# Altium schematic sheet EQDirect.SchDoc
size A4
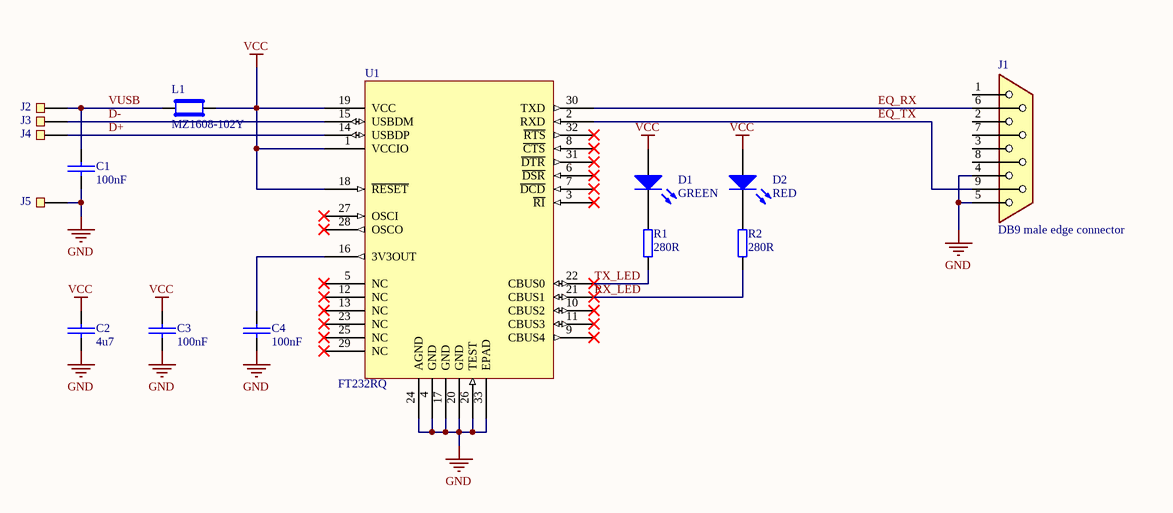
[diagram p0: EQDirect.SchDoc]

## Parts
C1  100nF  [C0603]
C2  4u7  [C0603]
C3  100nF  [C0603]
C4  100nF  [C0603]
D1  GREEN  [LED_0603_GREEN]
D2  RED  [LED_0603_RED]
J1  DB9 male edge connector  [DB9-M-EDGE]
J2  TH_PAD  [TH_PAD]  (value not drawn)
J3  TH_PAD  [TH_PAD]  (value not drawn)
J4  TH_PAD  [TH_PAD]  (value not drawn)
J5  TH_PAD  [TH_PAD]  (value not drawn)
L1  MZ1608-102Y  [L0603]
R1  280R  [R0603]
R2  280R  [R0603]
U1  FT232RQ  [QFN50P500X500X100_HS-33N]

## Nets
GND: C1.1 C2.1 C3.1 C4.1 J1.4 J1.5 J5.1 U1.4(GND) U1.17(GND) U1.20(GND) U1.24(AGND) U1.26(TEST) U1.33(EPAD)
VCC: C2.2 C3.2 D1.1(A) D2.1(A) L1.1 U1.1(VCCIO) U1.18(~{RESET}) U1.19(VCC)
D+: J4.1 U1.14(USBDP)
D-: J3.1 U1.15(USBDM)
EQ_RX: J1.6 U1.30(TXD)
EQ_TX: J1.9 U1.2(RXD)
RX_LED: R2.1 U1.21(CBUS1)
TX_LED: R1.1 U1.22(CBUS0)
VUSB: C1.2 J2.1 L1.2
NetC4_2: C4.2 U1.16(3V3OUT)
NetD1_2: D1.2(K) R1.2
NetD2_2: D2.2(K) R2.2

Not connected (* = marked no-connect by the designer): J1 1 2 3 7 8; U1 3(~{RI})* 5(NC)* 6(~{DSR})* 7(~{DCD})* 8(~{CTS})* 9(CBUS4)* 10(CBUS2)* 11(CBUS3)* 12(NC)* 13(NC)* 23(NC)* 25(NC)* 27(OSCI)* 28(OSCO)* 29(NC)* 31(~{DTR})* 32(~{RTS})*

## Library data of the parts
C1 C3 C4 = C0603C104K5RACTU: CAP CER 0.1UF 50V X7R 0603; Manufacturer: Kemet; Capacitance: 0.10µF; Tolerance: ±10%; Part Number: C0603C104K5RACTU; Value: 100nF; Supplier 1: Digi-Key; Supplier Part Number 1: 399-5089-1-ND; Manufacturer Part Number: C0603C104K5RACTU; RoHS: RoHS Compliant; Category: Capacitors; Stock 1: 1628757; Pricing 1: 1=0.09, 10=0.037, 50=0.0198, 100=0.0167, 250=0.01372, 500=0.01174, 1000=0.00914 (EUR); Packaging: Cut Tape (CT); Voltage - Rated: 50V; Temperature Coefficient: X7R; Mounting Type: Surface Mount, MLCC; Operating Temperature: -55°C ~ 125°C; Applications: General Purpose; Ratings: -; Package / Case: 0603 (1608 Metric); Size / Dimension: 0.063" L x 0.031" W (1.60mm x 0.80mm); Height - Seated (Max): -; Thickness (Max): 0.034" (0.87mm); Lead Spacing: -; Features: -; Lead Style: -; ComponentLink1URL: http://www.kemet.com/docfinder?Partnumber=C0603C104K5RACTU; ComponentLink1Description: http://www.kemet.com/docfinder?Partnumber=C0603C104K5RACTU
C2 = GRM188R6YA475KE15D: CAP CER 4.7UF 35V X5R 0603; Manufacturer: Murata Electronics North America; Capacitance: 4.7µF; Tolerance: ±10%; Part Number: GRM188R6YA475KE15D; Value: 4u7; Supplier 1: Digi-Key; Supplier Part Number 1: 490-7205-2-ND; Manufacturer Part Number: GRM188R6YA475KE15D; RoHS: RoHS Compliant; Category: Capacitors; Stock 1: 428000; Pricing 1: 4000=0.05995, 8000=0.05671, 12000=0.05379, 28000=0.05185, 100000=0.04294 (EUR); Packaging: Tape & Reel (TR); Voltage - Rated: 35V; Temperature Coefficient: X5R; Mounting Type: Surface Mount, MLCC; Operating Temperature: -55°C ~ 85°C; Applications: General Purpose; Ratings: -; Package / Case: 0603 (1608 Metric); Size / Dimension: 0.063" L x 0.031" W (1.60mm x 0.80mm); Height - Seated (Max): -; Thickness (Max): 0.031" (0.80mm); Lead Spacing: -; Features: -; Lead Style: -; ComponentLink1URL: http://www.murata.com/~/media/webrenewal/support/library/catalog/products/capacitor/mlcc/c02e.ashx; ComponentLink1Description: http://www.murata.com/~/media/webrenewal/support/library/catalog/products/capacitor/mlcc/c02e.ashx; Part Status: Active
D1 = LTST-C190KGKT: LED GREEN CLEAR 0603 SMD; Manufacturer: Lite-On Inc.; Voltage - Forward (Vf) (Typ): 2V; Viewing Angle: 130°; Wavelength - Dominant: 571nm; Wavelength - Peak: 574nm; Millicandela Rating: 35mcd; Current - Test: 20mA; Lens Color: Colorless; Lens Style/Size: Rectangle with Flat Top, 1.10mm x 0.80mm; Part Number: LTST-C190KGKT; Value: GREEN; Supplier 1: Digi-Key; Supplier Part Number 1: 160-1435-1-ND; Manufacturer Part Number: LTST-C190KGKT; RoHS: RoHS Compliant; Category: Optoelectronics; Stock 1: 1245030; Pricing 1: 1=0.24, 10=0.176, 25=0.1296, 100=0.0926, 250=0.063, 500=0.05556, 1000=0.04353 (EUR); Packaging: Cut Tape (CT); Mounting Type: Surface Mount; Package / Case: 0603 (1608 Metric); ComponentLink1URL: http://optoelectronics.liteon.com/upload/download/DS22-2000-074/S_110_LTST-C190KGKT.pdf; ComponentLink1Description: http://optoelectronics.liteon.com/upload/download/DS22-2000-074/S_110_LTST-C190KGKT.pdf; Supplier Device Package: *; Color: Green; Lens Transparency: Clear; Size / Dimension: 1.60mm L x 0.80mm W; Height (Max): 0.80mm; Features: -
D2 = LTST-C190KRKT: LED RED CLEAR 0603 SMD; Manufacturer: Lite-On Inc.; Voltage - Forward (Vf) (Typ): 2V; Viewing Angle: 130°; Wavelength - Dominant: 631nm; Wavelength - Peak: 639nm; Millicandela Rating: 99mcd; Current - Test: 20mA; Lens Color: Colorless; Lens Style/Size: Rectangle with Flat Top, 1.10mm x 0.80mm; Part Number: LTST-C190KRKT; Value: RED; Supplier 1: Digi-Key; Supplier Part Number 1: 160-1436-1-ND; Manufacturer Part Number: LTST-C190KRKT; RoHS: RoHS Compliant; Category: Optoelectronics; Stock 1: 1183099; Pricing 1: 1=0.24, 10=0.176, 25=0.1296, 100=0.0926, 250=0.063, 500=0.05556, 1000=0.04353 (EUR); Packaging: Cut Tape (CT); Mounting Type: Surface Mount; Package / Case: 0603 (1608 Metric); ComponentLink1URL: http://optoelectronics.liteon.com/upload/download/DS-22-99-0151/S_110_LTST-C190KRKT.pdf; ComponentLink1Description: http://optoelectronics.liteon.com/upload/download/DS-22-99-0151/S_110_LTST-C190KRKT.pdf; Supplier Device Package: *; Color: Red; Lens Transparency: Clear; Size / Dimension: 1.60mm L x 0.80mm W; Height (Max): 0.80mm; Features: -
J1 = DB9_M_EDGE
L1 = MZ1608-102Y: FERRITE BEAD 1 KOHM 0603 1LN; Manufacturer: Bourns Inc.; Filter Type: Power, Signal Line; Number of Lines: 1; Impedance @ Frequency: 1 kOhm @ 100MHz; Current Rating (Max): 100mA; DC Resistance (DCR) (Max): 600 mOhm; Part Number: MZ1608-102Y; Value: MZ1608-102Y; Supplier 1: Digi-Key; Supplier Part Number 1: MZ1608-102YCT-ND; Manufacturer Part Number: MZ1608-102Y; RoHS: RoHS Compliant; Category: Filters; Stock 1: 33555; Pricing 1: 1=0.09, 10=0.049, 25=0.0444, 50=0.0402, 100=0.0295, 250=0.02144, 500=0.01966, 1000=0.01696 (EUR); Packaging: Cut Tape (CT); Part Status: Active; Ratings: -; Operating Temperature: -55°C ~ 125°C; Package / Case: 0603 (1608 Metric); Mounting Type: Surface Mount; Height (Max): 0.039" (1.00mm); Size / Dimension: 0.063" L x 0.031" W (1.60mm x 0.80mm); ComponentLink1URL: http://www.bourns.com/docs/Product-Datasheets/mgmumz.pdf; ComponentLink1Description: http://www.bourns.com/docs/Product-Datasheets/mgmumz.pdf
R1 R2 = RC0603FR-07280RL: RES SMD 280 OHM 1% 1/10W 0603; Manufacturer: Yageo; Resistance (Ohms): 280; Power (Watts): 0.1W, 1/10W; Temperature Coefficient: ±100ppm/°C; Part Number: RC0603FR-07280RL; Value: 280R; Manufacturer Part Number: RC0603FR-07280RL; RoHS: RoHS Compliant; Category: Resistors; Stock 1: 47; Pricing 1: 1=0.09, 10=0.012, 25=0.0088, 50=0.0066, 100=0.0049, 250=0.00372, 500=0.00298, 1000=0.0022 (EUR); Packaging: Cut Tape (CT); Tolerance: ±1%; Composition: Thick Film; Features: Moisture Resistant; Operating Temperature: -55°C ~ 155°C; Package / Case: 0603 (1608 Metric); Supplier Device Package: 0603; Size / Dimension: 0.063" L x 0.031" W (1.60mm x 0.80mm); ComponentLink1URL: http://www.yageo.com/documents/recent/PYu-RC_Group_51_RoHS_L_6.pdf; ComponentLink1Description: http://www.yageo.com/documents/recent/PYu-RC_Group_51_RoHS_L_6.pdf; Supplier 1: Digi-Key; Supplier Part Number 1: 311-280HRCT-ND; Height - Seated (Max): 0.022" (0.55mm); Part Status: Active; Failure Rate: -
U1 = FT232RQ-REEL: IC USB FS SERIAL UART 32-QFN; Manufacturer: FTDI; Data Rate: 12Mbps; Number of Channels: 1; Operating Supply Voltage: 5V; Max Supply Voltage: 5.25V; Min Supply Voltage: 3.3V; Operating Supply Current: 15mA; Part Number: FT232RQ-REEL; Value: FT232RQ; Supplier 1: Digi-Key; Supplier Part Number 1: 768-1008-1-ND; Manufacturer Part Number: FT232RQ-REEL; Stock 1: 94833; Pricing 1: 1=4.5, 10=4.05, 100=3.65, 250=3.25, 500=2.85, 1000=2.65, 2500=2.35 (USD); Packaging: Tape and Reel; Interface: UART; ComponentLink1URL: https://datasheet.ciiva.com/1505/1647396-1505445.pdf; ComponentLink1Description: https://datasheet.ciiva.com/1505/1647396-1505445.pdf; Mount: Surface Mount; Case/Package: QFN EP; Number of Pins: 32; Weight: 0.006653oz; Min Operating Temperature: -40°C; Max Operating Temperature: 85°C; Package Quantity: 6000; Length: 5mm; Width: 5mm; Radiation Hardening: No; Lead Free: Lead Free; ComponentLink2URL: https://datasheet.ciiva.com/26841/ft232rq-reel-26841082.pdf; ComponentLink2Description: https://datasheet.ciiva.com/26841/ft232rq-reel-26841082.pdf; ComponentLink3URL: https://datasheet.ciiva.com/15150/getdatasheetpartid-644721-15150509.pdf; ComponentLink3Description: https://datasheet.ciiva.com/15150/getdatasheetpartid-644721-15150509.pdf; ComponentLink4URL: https://datasheet.ciiva.com/4787/ds-ft232r-4787663.pdf; ComponentLink4Description: https://datasheet.ciiva.com/4787/ds-ft232r-4787663.pdf; ComponentLink5URL: https://datasheet.ciiva.com/16438/ds-ft232r-16438555.pdf; ComponentLink5Description: https://datasheet.ciiva.com/16438/ds-ft232r-16438555.pdf; ComponentLink6URL: https://datasheet.ciiva.com/1787/ds-ft232r-1787042.pdf; ComponentLink6Description: https://datasheet.ciiva.com/1787/ds-ft232r-1787042.pdf; ComponentLink7URL: https://datasheet.ciiva.com/1787/ds-ft232r-1787041.pdf; ComponentLink7Description: https://datasheet.ciiva.com/1787/ds-ft232r-1787041.pdf